# Altium project DS153-1.0-C氢气传感器.PrjPcb
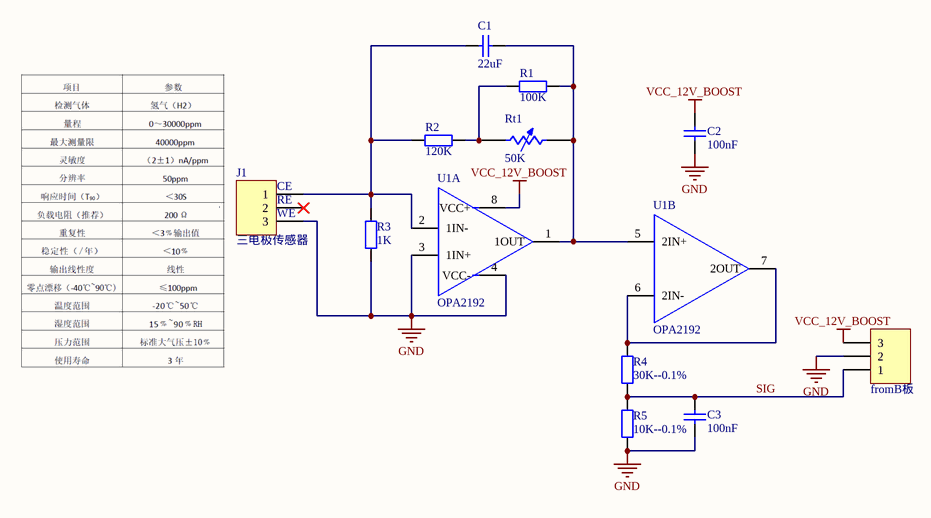
[diagram p0: DS153-1.0-C氢气传感器.SchDoc]
1 sheet, 12 parts. Net scope: global (net labels, ports and power ports of the same name join across sheets).
Board file: DS153-1.0-C氢气传感器.PcbDoc

## Sheet DS153-1.0-C氢气传感器.SchDoc
size A4; SheetNumber: 1; SheetTotal: 1

### Parts
1  value fromB板  [XH2.54-3P]  (hidden comment: SL000000028)
C1  value 22uF  [1206CAP]  (hidden comment: MLCC 22uF 50V ±20％ 1206)
C2  value 100nF  [0603CAP]  (hidden comment: SMDCAP00013)
C3  value 100nF  [0603CAP]  (hidden comment: SMDCAP00013)
J1  value 三电极传感器  [2_Electrode]  (hidden comment: SL000000042)
R1  value 100K  [0603RES]  (hidden comment: SMDRES00071)
R2  value 120K  [0603RES]  (hidden comment: Chip 120K 1/16W ±1％ 0603)
R3  value 1K  [0603RES]  (hidden comment: SMDRES00034)
R4  value 30K--0.1%  [0603RES]  (hidden comment: SMDRES00060)
R5  value 10K--0.1%  [0603RES]  (hidden comment: SMDRES00056)
Rt1  value 50K  [0603RES]  (hidden comment: SE000000015)
U1  OPA2192  [SO-8]  (parts A,B of 2)

### Nets
GND: 1.2 C2.1 C3.1 J1.3 R3.1 R5.1 U1.3(1IN+) U1.4(VCC-)
VCC_12V_BOOST: 1.3 C2.2 U1.8(VCC+)
SIG: 1.1 C3.2 R4.1 R5.2
NetC1_1: C1.1 J1.1 R2.1 R3.2 U1.2(1IN-)
NetC1_2: C1.2 R1.2 Rt1.1 U1.1(1OUT) U1.5(2IN+)
NetR1_1: R1.1 R2.2 Rt1.2
NetR4_2: R4.2 U1.6(2IN-) U1.7(2OUT)

Not connected (* = marked no-connect by the designer): J1 2*

### Notes on the sheet
- (near J1) CE
- (near J1) RE
- (near J1) WE

### Library data of the parts
1 = XH2.54mm-3A 直针座: 3P直针座
C1 = MLCC 22uF 50V ±20％ 1206: 贴片电容
C2 C3 = MLCC 100nF 50V ±10％ 0603: 贴片电容
J1 = DIP3 单排直针 间距2.54mm 针长11mm 铜: 单排直针
R1 = Chip 100K 1/16W ±1％ 0603: 贴片电阻
R2 = Chip 120K 1/16W ±1％ 0603: 贴片电阻
R3 = Chip 1K 1/16W ±1％ 0603: 贴片电阻
R4 = Chip 30K 1/16W ±1％ 0603: 贴片电阻
R5 = Chip 10K 1/16W ±1％ 0603: 贴片电阻
Rt1 = NTC 10K 热敏电阻 5% Φ5 MF52A1 B值:3950K: 热敏电阻
U1 = TL062C